# Altium schematic sheet 下层功率板(铝基).SchDoc
size A4; SheetNumber: 2; SheetTotal: 3
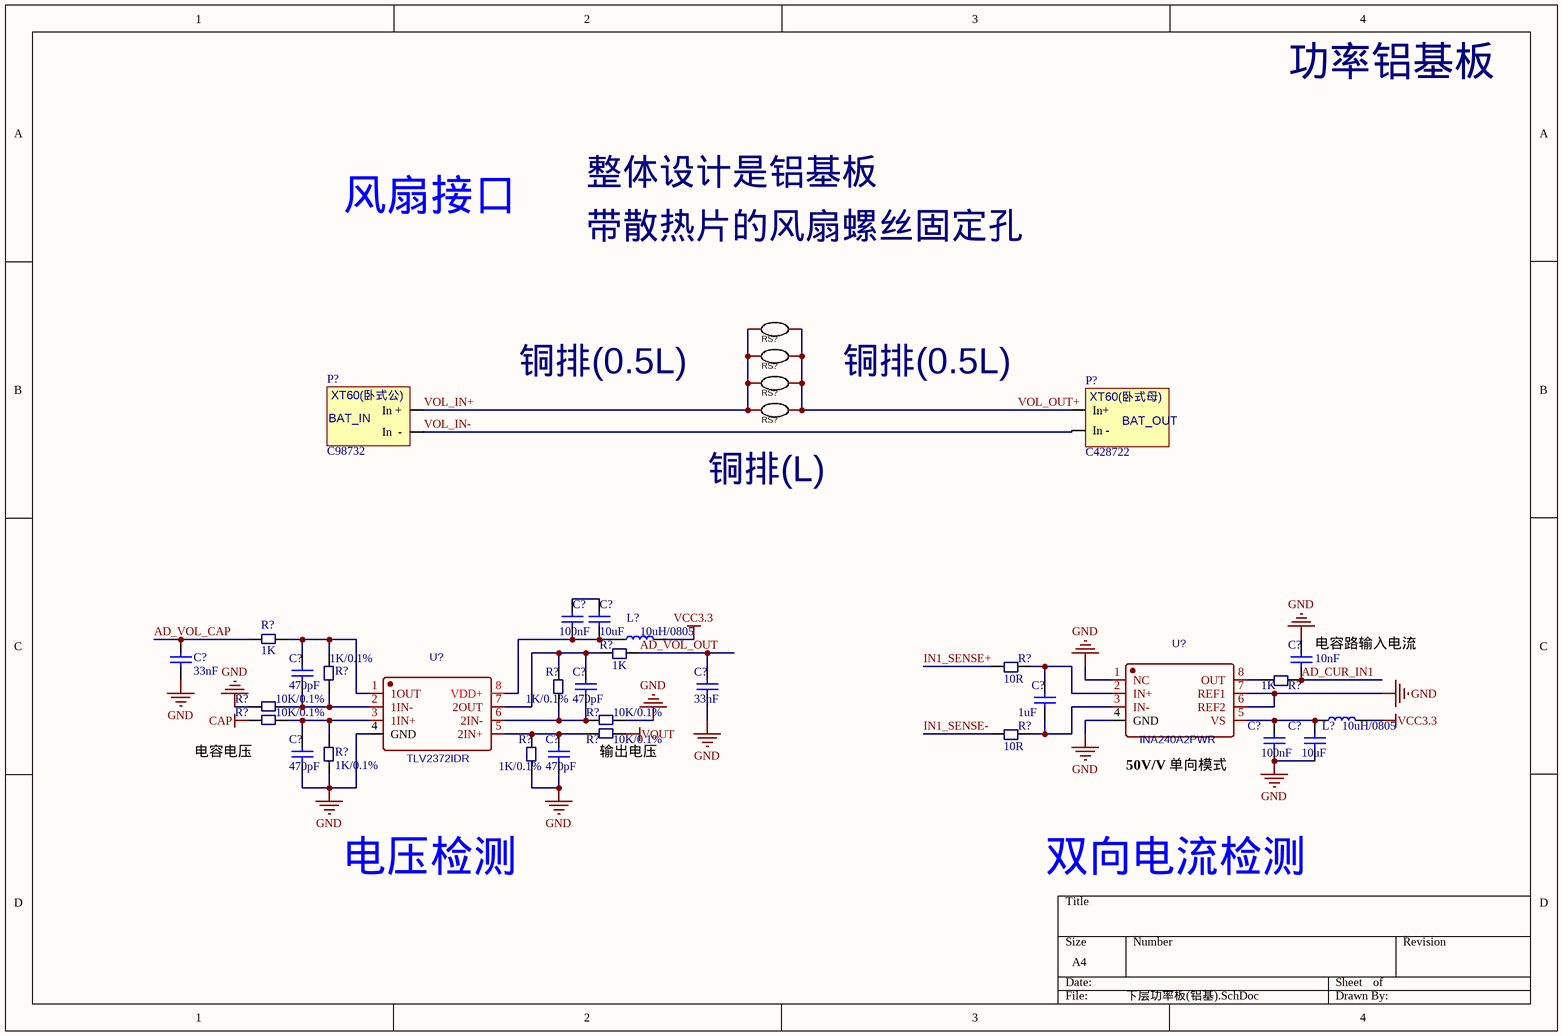
[diagram p0: 下层功率板(铝基).SchDoc]

## Parts
(Parts that share a designator on the sheet are numbered #1, #2 ... from top to bottom, then left to right.)
C?#1  100nF  [C_0603]
C?#2  10uF  [C_0603]
C?#3  33nF  [C_0603]
C?#4  10nF  [C_0603]
C?#5  470pF  [C_0603]
C?#6  470pF  [C_0603]
C?#7  33nF  [C_0603]
C?#8  1uF  [C_0603]
C?#9  100nF  [C_0603]
C?#10  10uF  [C_0603]
C?#11  470pF  [C_0603]
C?#12  470pF  [C_0603]
L?#1  10uH/0805  [L_0805]
L?#2  10uH/0805  [L_0805]
P?#1  C428722  [TX60PW-F20]
P?#2  C98732  [TX60PW-M20]
R?#1  1K  [R_0603]
R?#2  1K  [R_0603]
R?#3  1K/0.1%  [R_0603]
R?#4  10R  [R_0603]
R?#5  1K/0.1%  [R_0603]
R?#6  1K  [R_0603]
R?#7  10K/0.1%  [R_0603]
R?#8  10K/0.1%  [R_0603]
R?#9  10K/0.1%  [R_0603]
R?#10  10K/0.1%  [R_0603]
R?#11  10R  [R_0603]
R?#12  1K/0.1%  [R_0603]
R?#13  1K/0.1%  [R_0603]
RS?#1  HolRS3920-5W-0.3mR-1%  [R3920]  (value not drawn)
RS?#2  HolRS3920-5W-0.3mR-1%  [R3920]  (value not drawn)
RS?#3  HolRS3920-5W-0.3mR-1%  [R3920]  (value not drawn)
RS?#4  HolRS3920-5W-0.3mR-1%  [R3920]  (value not drawn)
U?#1  INA240A2PWR  [TSSOP-8_L4.4-W3.0-P0.65-LS6.4-BL]
U?#2  TLV2372IDR  [SOIC_8]

## Nets
CAP: R?#8.2
GND: C?#3.1 C?#4.2 C?#7.1 C?#9.1 C?#10.1 C?#11.1 C?#12.1 R?#7.2 R?#9.1 R?#12.2 R?#13.2 U?#1.1(NC) U?#1.4(GND) U?#1.6(REF2) U?#1.7(REF1) U?#2.4(GND)
VCC3.3: L?#1.2 L?#2.2
VOUT: R?#10.1
AD_CUR_IN1: C?#4.1 R?#6.2
AD_VOL_CAP: C?#3.2 R?#1.2
AD_VOL_OUT: C?#7.2 R?#2.2
IN1_SENSE+: R?#4.1
IN1_SENSE-: R?#11.1
VOL_IN+: P?#2.1(In_+) RS?#1.1 RS?#2.1 RS?#3.1 RS?#4.1
VOL_IN-: P?#1.2(In_-) P?#2.2(In__-)
VOL_OUT+: P?#1.1(In+) RS?#1.2 RS?#2.2 RS?#3.2 RS?#4.2
NetC?#1_1: C?#1.1 C?#2.1
NetC?#1_2: C?#1.2 C?#2.2 L?#1.1 U?#2.8(VDD+)
NetC?#5_1: C?#5.1 R?#3.2 R?#7.1 U?#2.2(1IN-)
NetC?#5_2: C?#5.2 R?#1.1 R?#3.1 U?#2.1(1OUT)
NetC?#6_1: C?#6.1 R?#5.2 R?#9.2 U?#2.6(2IN-)
NetC?#6_2: C?#6.2 R?#2.1 R?#5.1 U?#2.7(2OUT)
NetC?#8_1: C?#8.1 R?#11.2 U?#1.3(IN-)
NetC?#8_2: C?#8.2 R?#4.2 U?#1.2(IN+)
NetC?#9_2: C?#9.2 C?#10.2 L?#2.1 U?#1.5(VS)
NetC?#11_2: C?#11.2 R?#8.1 R?#12.1 U?#2.3(1IN+)
NetC?#12_2: C?#12.2 R?#10.2 R?#13.1 U?#2.5(2IN+)
NetR?#6_1: R?#6.1 U?#1.8(OUT)

## Notes on the sheet
- 功率铝基板
- 风扇接口
- 带散热片的风扇螺丝固定孔
- 整体设计是铝基板
- 铜排(0.5L)
- (near RS?#4) 铜排(L)
- (near C?#4) 电容路输入电流
- (near R?#8) 电容电压
- (near R?#10) 输出电压
- (near U?#1) 50V/V 单向模式
- 电压检测
- 双向电流检测
- (in symbol P_PW_XT60_FM_卧式) XT60(卧式母); BAT_OUT
- (in symbol P_PW_XT60_M_卧式) XT60(卧式公); BAT_IN

## Library data of the parts
C?#1-C?#12 = Cap: Capacitor; Published: 8-Jun-2000; LatestRevisionDate: 17-Jul-2002; LatestRevisionNote: Re-released for DXP Platform.; PackageReference: RAD-0.3; Publisher: Altium Limited; PackageDescription: Radial Cap, Thru-Hole; 2 Leads; 0.3 in Pin Spacing
L?#1 L?#2 = Inductor: Code_IEC: 1005; Published: 8-Jun-2000; LatestRevisionDate: 17-Jul-2002; LatestRevisionNote: Re-released for DXP Platform.; PackageReference: 0402-A; Publisher: Altium Limited; Code_JEITA: 0402
P?#1 = P_PW_XT60_FM_卧式: XT60_PW_M / XT60母头输入
P?#2 = P_PW_XT60_M_卧式: XT60_PW_M / XT60公头输入
R?#1-R?#13 = Res: Resistor; Published: 8-Jun-2000; LatestRevisionDate: 17-Jul-2002; LatestRevisionNote: Re-released for DXP Platform.; PackageReference: AXIAL-0.4; Publisher: Altium Limited
RS?#1-RS?#4 = C558626: Manufacturer: Milliohm(毫欧); Name: 0.3mΩ; Add into BOM: yes; Value: 0.3mΩ; Tolerance: ±1%; Power(Watts): 5W; Symbol: HOLRS3920-5W-0.3MR-1%; Device: HolRS3920-5W-0.3mR-1%; LCSC Part Name: 0.3mΩ ±1% 5W; Supplier Part: C558626; Manufacturer Part: HolRS3920-5W-0.3mR-1%; Supplier Footprint: 3920; JLCPCB Part Class: Extended Part; Datasheet: https://atta.szlcsc.com/upload/public/pdf/source/20200522/C558625_7915B34B9186274EB7EA9862EBA9CEA8.pdf; Supplier: LCSC; Convert to PCB: yes
U?#1 = INA240A1PWR: BOM_Manufacturer: TI; Contributor: LCSC; SMT Type: Extend; BOM_Supplier: LCSC; BOM_Manufacturer Part: INA240A1PWR; BOM_Supplier Part: C93965; BOM_LCSC Assembly: Yes; spicePre: U; spiceSymbolName: INA240A1PWR
U?#2 = TLV2372IDR: BOM_Manufacturer: TI; SMT Type: Extend; BOM_Supplier: LCSC; BOM_Manufacturer Part: TLV2372IDR; BOM_Supplier Part: C27204; BOM_LCSC Assembly: Yes; spicePre: U; spiceSymbolName: TLV2372IDR